# Altium project Deepth-Sapphire-MP2.PrjPcb
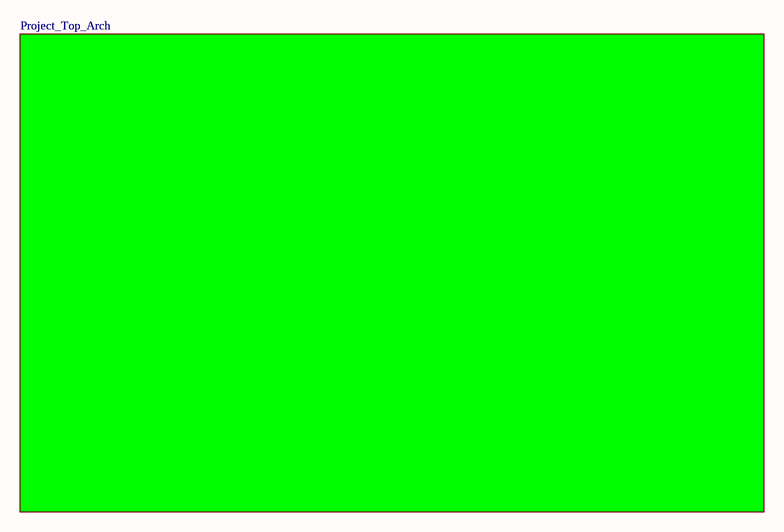
[diagram p0: Project_Overview.SchDoc]
5 sheets, 13 parts. Net scope: global (net labels, ports and power ports of the same name join across sheets).
Board file: PCB.PcbDoc
Sheets:
  Project_Overview.SchDoc
    Project_Top_Arch = Project_Top_Arch.SchDoc
      Power_PMIC = Power_PMIC.SchDoc
      Power_MPU = Power_MPU.SchDoc
      LPDDR4_32Bits = LPDDR4_32Bits.SchDoc

## Sheet Project_Overview.SchDoc
size A2; SheetNumber: 1; SheetTotal: 5

### Sub-sheets
Project_Top_Arch = Project_Top_Arch: no entries

## Sheet Project_Top_Arch.SchDoc
size A2; SheetNumber: 2; SheetTotal: 5
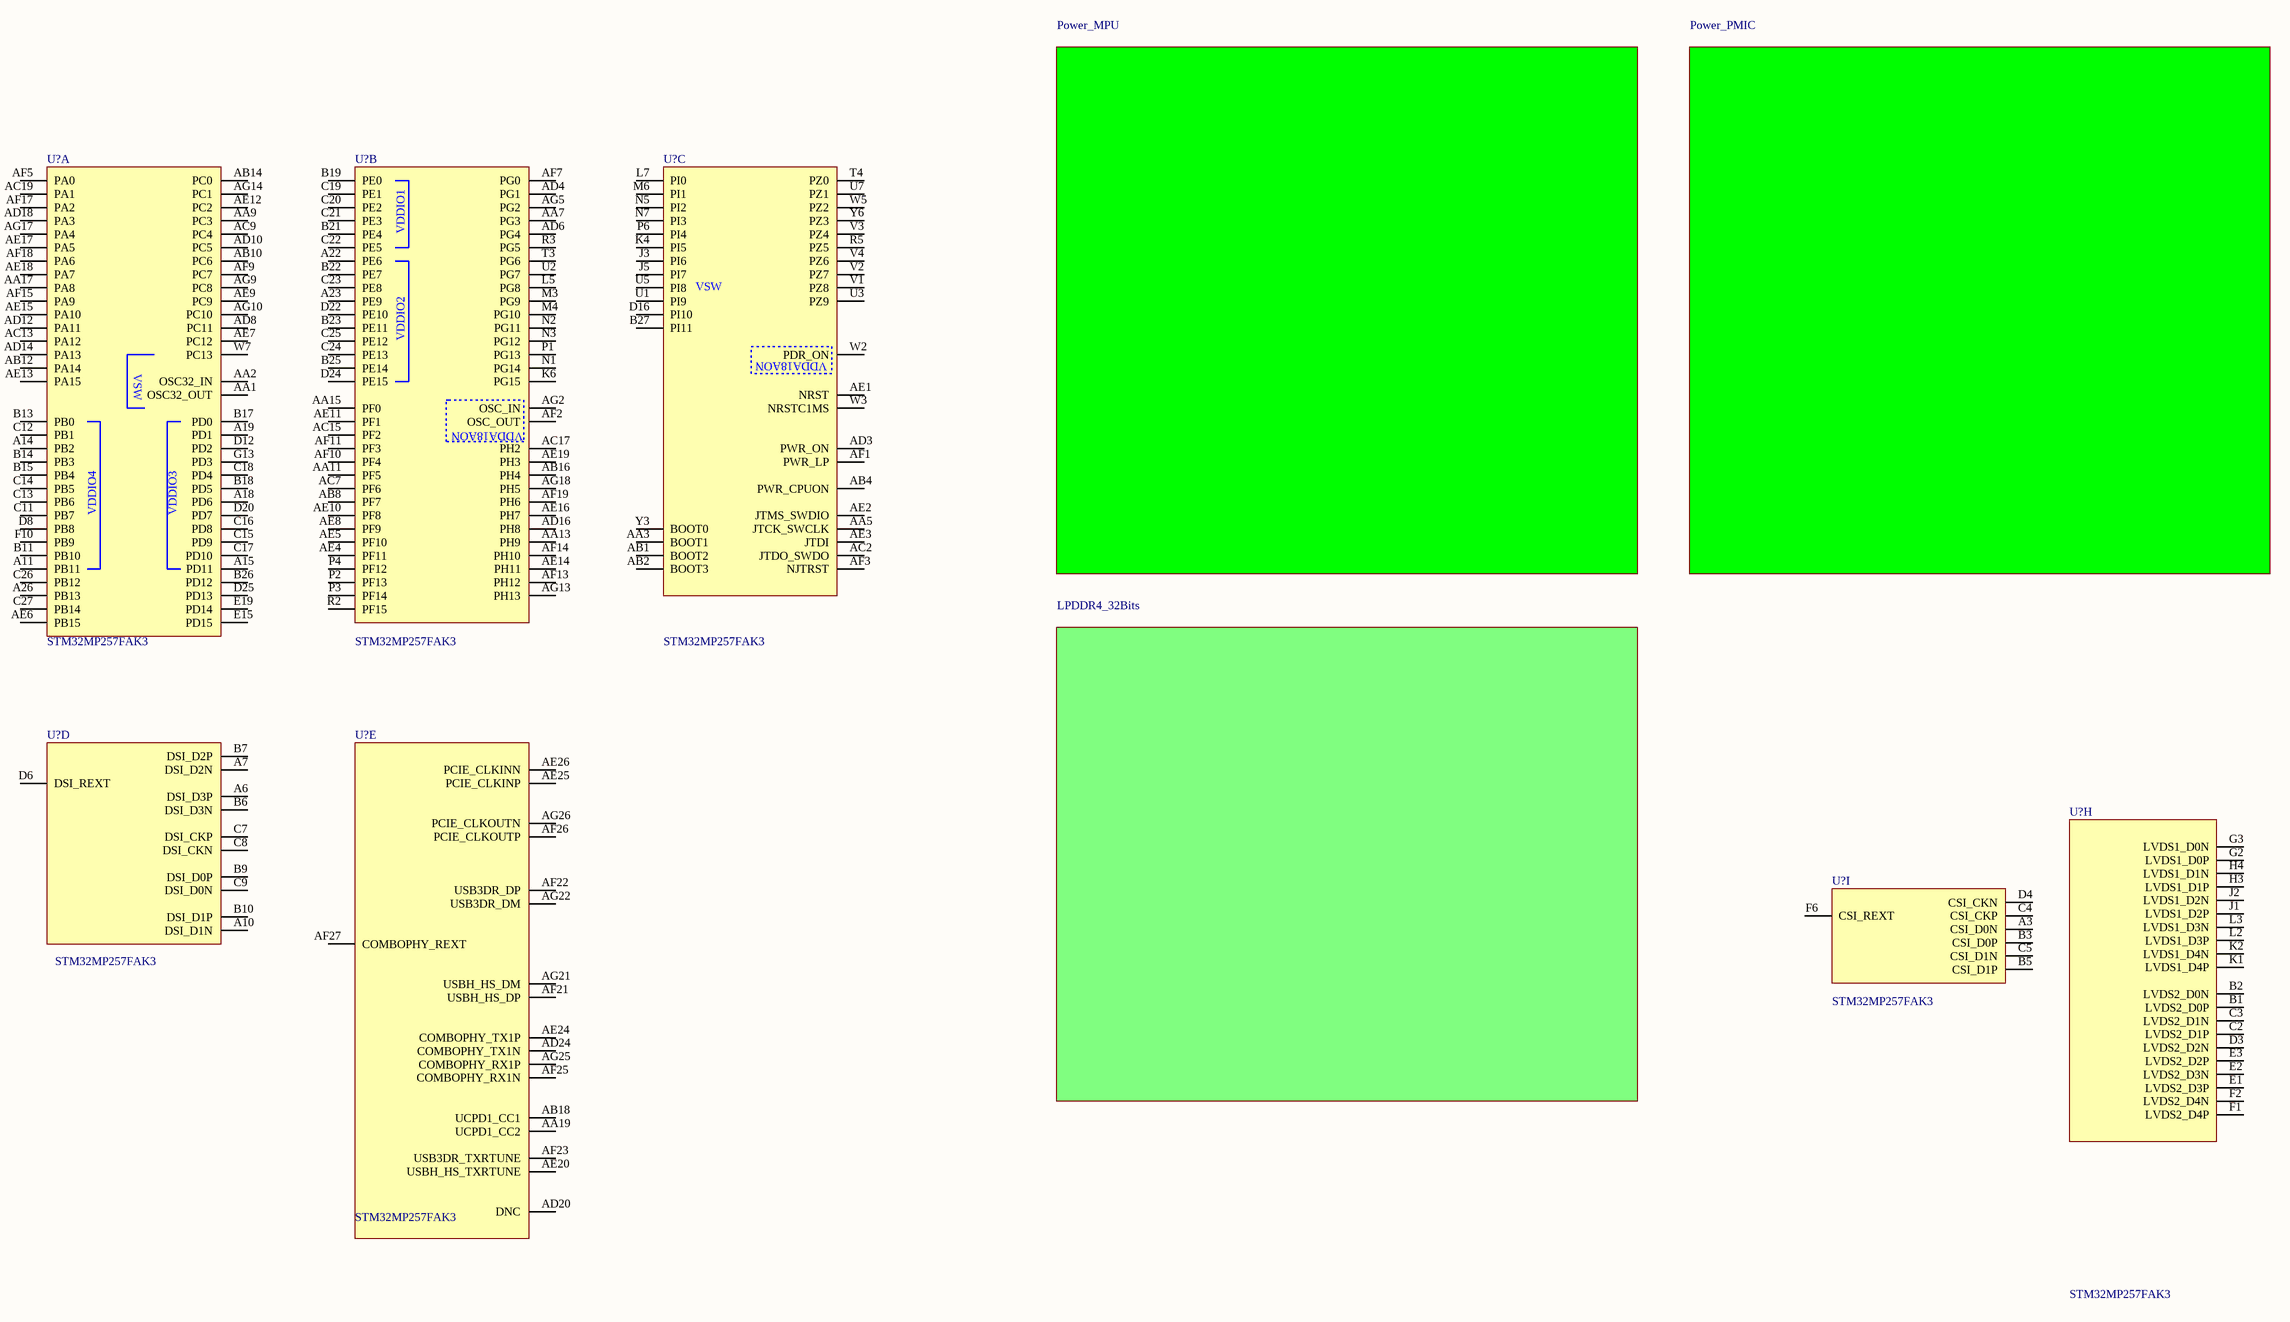
[diagram p1: Project_Top_Arch.SchDoc]

### Parts
(Parts that share a designator on the sheet are numbered #1, #2 ... from top to bottom, then left to right.)
U?#1  STM32MP257FAK3  [ICC_TFBGA424_14X14_P050_H1P20_CODE-B0A2]  (part A of 9)
U?#2  STM32MP257FAK3  [ICC_TFBGA424_14X14_P050_H1P20_CODE-B0A2]  (part B of 9)
U?#3  STM32MP257FAK3  [ICC_TFBGA424_14X14_P050_H1P20_CODE-B0A2]  (part C of 9)
U?#4  STM32MP257FAK3  [ICC_TFBGA424_14X14_P050_H1P20_CODE-B0A2]  (part D of 9)
U?#5  STM32MP257FAK3  [ICC_TFBGA424_14X14_P050_H1P20_CODE-B0A2]  (part E of 9)
U?#6  STM32MP257FAK3  [ICC_TFBGA424_14X14_P050_H1P20_CODE-B0A2]  (part H of 9)
U?#7  STM32MP257FAK3  [ICC_TFBGA424_14X14_P050_H1P20_CODE-B0A2]  (part I of 9)

### Sub-sheets
LPDDR4_32Bits = LPDDR4_32Bits: no entries
Power_MPU = Power_MPU: no entries
Power_PMIC = Power_PMIC: no entries

### Nets

Not connected (* = marked no-connect by the designer): U?#1 A11(PB11) A14(PB2) A15(PD11) A18(PD6) A19(PD1) A26(PB13) AA1(OSC32_OUT) AA2(OSC32_IN) AA9(PC3) AA17(PA8) AB10(PC6) AB12(PA14) AB14(PC0) AC9(PC4) AC13(PA12) AC19(PA1) AD8(PC11) AD10(PC5) AD12(PA11) AD14(PA13) AD18(PA3) AE6(PB15) AE7(PC12) AE9(PC9) AE12(PC2) AE13(PA15) AE15(PA10) AE17(PA5) AE18(PA7) AF5(PA0) AF9(PC7) AF15(PA9) AF17(PA2) AF18(PA6) AG9(PC8) AG10(PC10) AG14(PC1) AG17(PA4) B11(PB10) B13(PB0) B14(PB3) B15(PB4) B17(PD0) B18(PD5) B26(PD12) C11(PB7) C12(PB1) C13(PB6) C14(PB5) C15(PD9) C16(PD8) C17(PD10) C18(PD4) C26(PB12) C27(PB14) D8(PB8) D12(PD2) D20(PD7) D25(PD13) E15(PD15) E19(PD14) F10(PB9) G13(PD3) W7(PC13); U?#2 A22(PE6) A23(PE9) AA7(PG3) AA11(PF5) AA13(PH9) AA15(PF0) AB8(PF7) AB16(PH4) AC7(PF6) AC15(PF2) AC17(PH2) AD4(PG1) AD6(PG4) AD16(PH8) AE4(PF11) AE5(PF10) AE8(PF9) AE10(PF8) AE11(PF1) AE14(PH11) AE16(PH7) AE19(PH3) AF2(OSC_OUT) AF7(PG0) AF10(PF4) AF11(PF3) AF13(PH12) AF14(PH10) AF19(PH6) AG2(OSC_IN) AG5(PG2) AG13(PH13) AG18(PH5) B19(PE0) B21(PE4) B22(PE7) B23(PE11) B25(PE14) C19(PE1) C20(PE2) C21(PE3) C22(PE5) C23(PE8) C24(PE13) C25(PE12) D22(PE10) D24(PE15) K6(PG15) L5(PG8) M3(PG9) M4(PG10) N1(PG14) N2(PG11) N3(PG12) P1(PG13) P2(PF13) P3(PF14) P4(PF12) R2(PF15) R3(PG5) T3(PG6) U2(PG7); U?#3 AA3(BOOT1) AA5(JTCK_SWCLK) AB1(BOOT2) AB2(BOOT3) AB4(PWR_CPUON) AC2(JTDO_SWDO) AD3(PWR_ON) AE1(NRST) AE2(JTMS_SWDIO) AE3(JTDI) AF1(PWR_LP) AF3(NJTRST) B27(PI11) D16(PI10) J3(PI6) J5(PI7) K4(PI5) L7(PI0) M6(PI1) N5(PI2) N7(PI3) P6(PI4) R5(PZ5) T4(PZ0) U1(PI9) U3(PZ9) U5(PI8) U7(PZ1) V1(PZ8) V2(PZ7) V3(PZ4) V4(PZ6) W2(PDR_ON) W3(NRSTC1MS) W5(PZ2) Y3(BOOT0) Y6(PZ3); U?#4 A6(DSI_D3P) A7(DSI_D2N) A10(DSI_D1N) B6(DSI_D3N) B7(DSI_D2P) B9(DSI_D0P) B10(DSI_D1P) C7(DSI_CKP) C8(DSI_CKN) C9(DSI_D0N) D6(DSI_REXT); U?#5 AA19(UCPD1_CC2) AB18(UCPD1_CC1) AD20(DNC) AD24(COMBOPHY_TX1N) AE20(USBH_HS_TXRTUNE) AE24(COMBOPHY_TX1P) AE25(PCIE_CLKINP) AE26(PCIE_CLKINN) AF21(USBH_HS_DP) AF22(USB3DR_DP) AF23(USB3DR_TXRTUNE) AF25(COMBOPHY_RX1N) AF26(PCIE_CLKOUTP) AF27(COMBOPHY_REXT) AG21(USBH_HS_DM) AG22(USB3DR_DM) AG25(COMBOPHY_RX1P) AG26(PCIE_CLKOUTN); U?#6 B1(LVDS2_D0P) B2(LVDS2_D0N) C2(LVDS2_D1P) C3(LVDS2_D1N) D3(LVDS2_D2N) E1(LVDS2_D3P) E2(LVDS2_D3N) E3(LVDS2_D2P) F1(LVDS2_D4P) F2(LVDS2_D4N) G2(LVDS1_D0P) G3(LVDS1_D0N) H3(LVDS1_D1P) H4(LVDS1_D1N) J1(LVDS1_D2P) J2(LVDS1_D2N) K1(LVDS1_D4P) K2(LVDS1_D4N) L2(LVDS1_D3P) L3(LVDS1_D3N); U?#7 A3(CSI_D0N) B3(CSI_D0P) B5(CSI_D1P) C4(CSI_CKP) C5(CSI_D1N) D4(CSI_CKN) F6(CSI_REXT)

### Notes on the sheet
- (in symbol STM32MP257FAK3_1, part A) VSW
- (in symbol STM32MP257FAK3_1, part C) VSW

### Library data of the parts
U?#1-U?#7 = STM32MP257FAK3_1: MPU , 2xCortex-A35@1.5GHz, Cortex-M33@400MHz, TFBGA 14x14, pitch 0.5, 648KB SRAM, With Crypto; Internal_Part_Number: MCD-03375; Part_Type: IC; Part_Preference: Recommended; Manufacturer: STMICROELECTRONICS; Component_Country_Of_Origin: Unknown; ShowFields: YES; ID: 5491; Value: STM32MP257FAK3; Status: Checked; Manufacturer_Part_Number: STM32MP257FAK3; Package: TFBGA; ComponentLink1URL: http://tunmcdsvn.tun.st.com/Component_Documentation_Library/Trunk/IC/STMICROELECTRONICS_STM32MP257FAK3; Order_Code_Digikey: N/A; Order_Code_Farnell: N/A; Order_Code_RS: N/A

## Sheet Power_PMIC.SchDoc
size A2; SheetNumber: 3; SheetTotal: 5

## Sheet Power_MPU.SchDoc
size A2; SheetNumber: 4; SheetTotal: 5
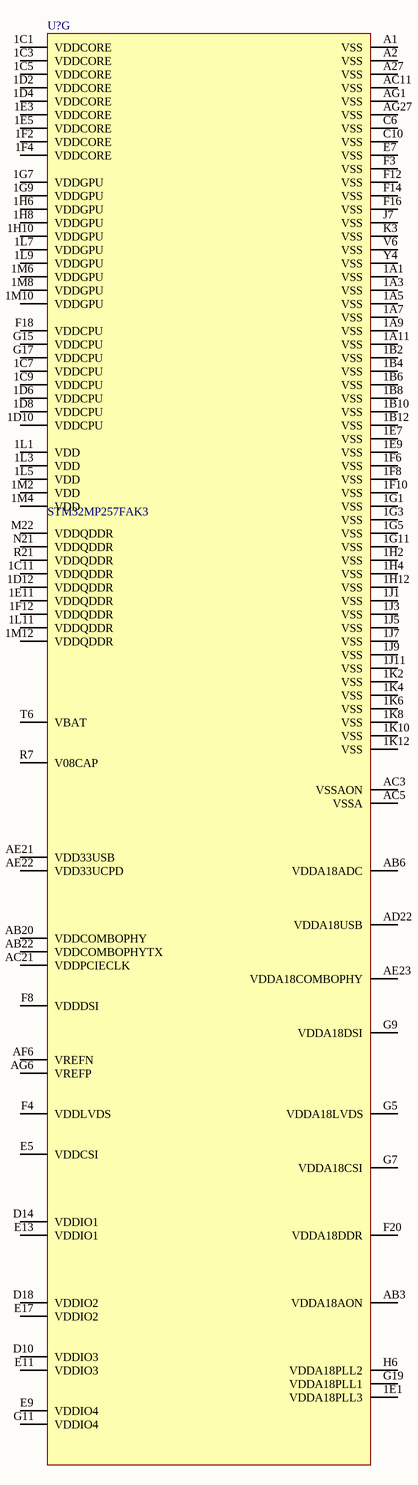
[diagram p2: Power_MPU.SchDoc]

### Parts
(Parts that share a designator on the sheet are numbered #1, #2 ... from top to bottom, then left to right.)
U?#8  STM32MP257FAK3  [ICC_TFBGA424_14X14_P050_H1P20_CODE-B0A2]  (part G of 9)

### Nets

Not connected (* = marked no-connect by the designer): U?#8 1A1(VSS) 1A3(VSS) 1A5(VSS) 1A7(VSS) 1A9(VSS) 1A11(VSS) 1B2(VSS) 1B4(VSS) 1B6(VSS) 1B8(VSS) 1B10(VSS) 1B12(VSS) 1C1(VDDCORE) 1C3(VDDCORE) 1C5(VDDCORE) 1C7(VDDCPU) 1C9(VDDCPU) 1C11(VDDQDDR) 1D2(VDDCORE) 1D4(VDDCORE) 1D6(VDDCPU) 1D8(VDDCPU) 1D10(VDDCPU) 1D12(VDDQDDR) 1E1(VDDA18PLL3) 1E3(VDDCORE) 1E5(VDDCORE) 1E7(VSS) 1E9(VSS) 1E11(VDDQDDR) 1F2(VDDCORE) 1F4(VDDCORE) 1F6(VSS) 1F8(VSS) 1F10(VSS) 1F12(VDDQDDR) 1G1(VSS) 1G3(VSS) 1G5(VSS) 1G7(VDDGPU) 1G9(VDDGPU) 1G11(VSS) 1H2(VSS) 1H4(VSS) 1H6(VDDGPU) 1H8(VDDGPU) 1H10(VDDGPU) 1H12(VSS) 1J1(VSS) 1J3(VSS) 1J5(VSS) 1J7(VSS) 1J9(VSS) 1J11(VSS) 1K2(VSS) 1K4(VSS) 1K6(VSS) 1K8(VSS) 1K10(VSS) 1K12(VSS) 1L1(VDD) 1L3(VDD) 1L5(VDD) 1L7(VDDGPU) 1L9(VDDGPU) 1L11(VDDQDDR) 1M2(VDD) 1M4(VDD) 1M6(VDDGPU) 1M8(VDDGPU) 1M10(VDDGPU) 1M12(VDDQDDR) A1(VSS) A2(VSS) A27(VSS) AB3(VDDA18AON) AB6(VDDA18ADC) AB20(VDDCOMBOPHY) AB22(VDDCOMBOPHYTX) AC3(VSSAON) AC5(VSSA) AC11(VSS) AC21(VDDPCIECLK) AD22(VDDA18USB) AE21(VDD33USB) AE22(VDD33UCPD) AE23(VDDA18COMBOPHY) AF6(VREFN) AG1(VSS) AG6(VREFP) AG27(VSS) C6(VSS) C10(VSS) D10(VDDIO3) D14(VDDIO1) D18(VDDIO2) E5(VDDCSI) E7(VSS) E9(VDDIO4) E11(VDDIO3) E13(VDDIO1) E17(VDDIO2) F3(VSS) F4(VDDLVDS) F8(VDDDSI) F12(VSS) F14(VSS) F16(VSS) F18(VDDCPU) F20(VDDA18DDR) G5(VDDA18LVDS) G7(VDDA18CSI) G9(VDDA18DSI) G11(VDDIO4) G15(VDDCPU) G17(VDDCPU) G19(VDDA18PLL1) H6(VDDA18PLL2) J7(VSS) K3(VSS) M22(VDDQDDR) N21(VDDQDDR) R7(V08CAP) R21(VDDQDDR) T6(VBAT) V6(VSS) Y4(VSS)

### Library data of the parts
U?#8 = STM32MP257FAK3_1: as U?#1 on sheet Project_Top_Arch; Value: STM32MP257FAK3; Status: Checked; Manufacturer_Part_Number: STM32MP257FAK3; Package: TFBGA; ComponentLink1URL: http://tunmcdsvn.tun.st.com/Component_Documentation_Library/Trunk/IC/STMICROELECTRONICS_STM32MP257FAK3; Order_Code_Digikey: N/A; Order_Code_Farnell: N/A; Order_Code_RS: N/A

## Sheet LPDDR4_32Bits.SchDoc
size A3; SheetNumber: 5; SheetTotal: 5
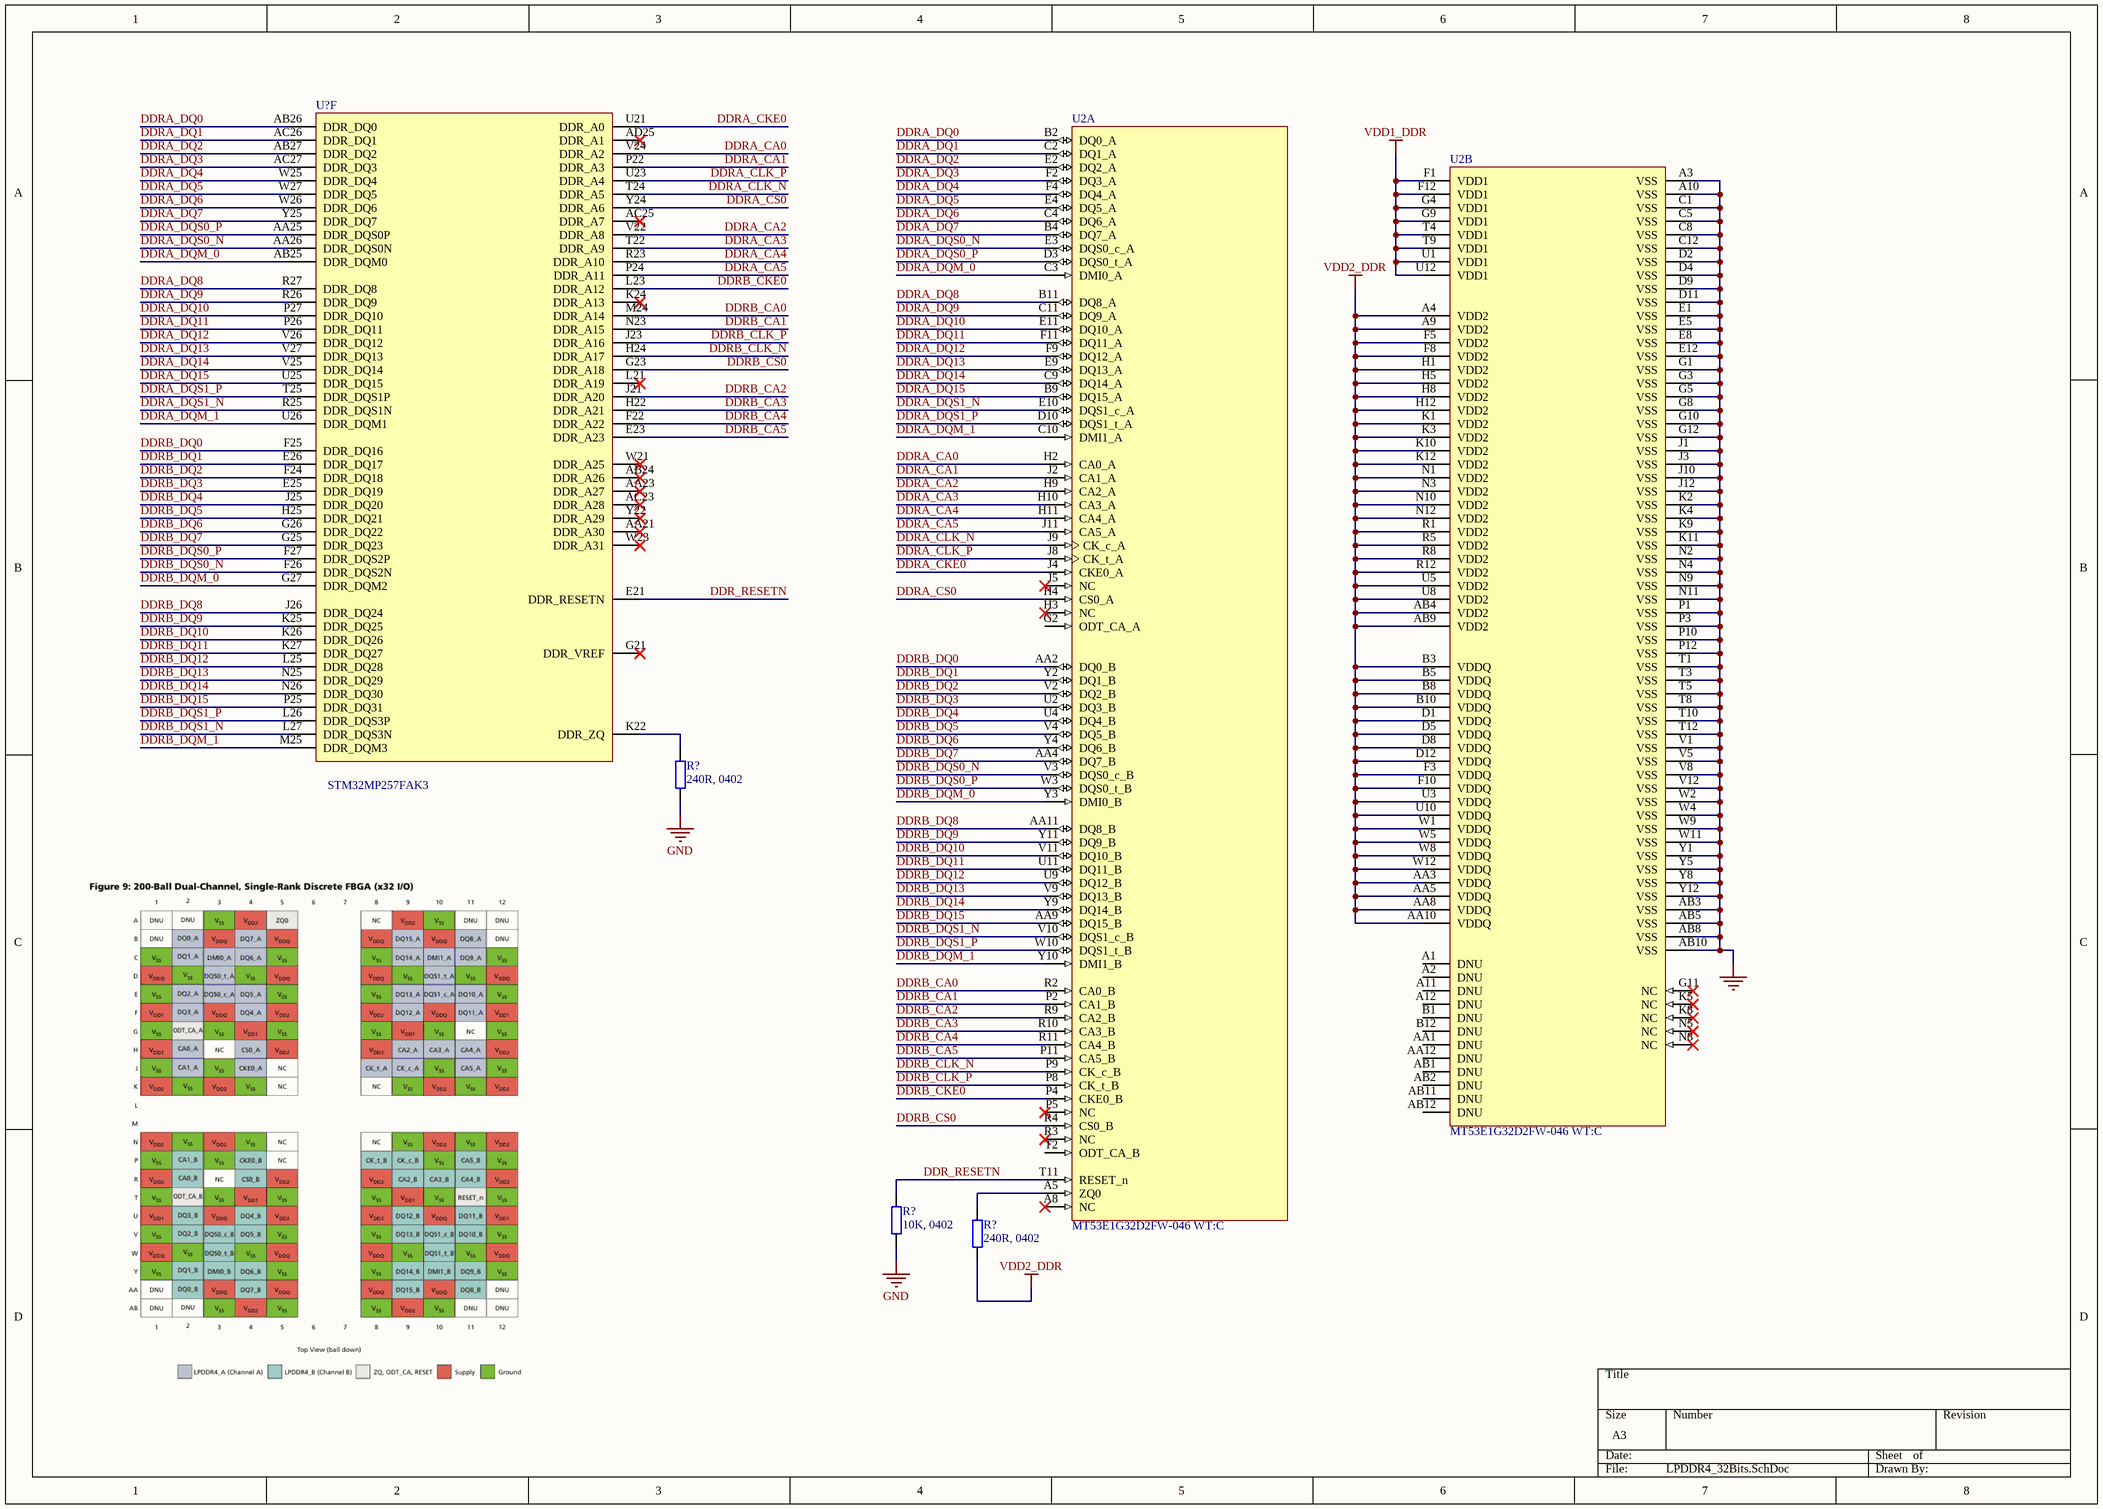
[diagram p3: LPDDR4_32Bits.SchDoc]

### Parts
(Parts that share a designator on the sheet are numbered #1, #2 ... from top to bottom, then left to right.)
R?#1  240R, 0402  [RES_0402]
R?#2  10K, 0402  [RES_0402]
R?#3  240R, 0402  [RES_0402]
U2  MT53E1G32D2FW-046 WT:C  [ICC_TFBGA200_10X14P5_P080_H1P05_PS0P3]  (parts A,B of 2)
U?#9  STM32MP257FAK3  [ICC_TFBGA424_14X14_P050_H1P20_CODE-B0A2]  (part F of 9)

### Nets
GND: R?#1.1 R?#2.1 U2.A3(VSS) U2.A10(VSS) U2.AB3(VSS) U2.AB5(VSS) U2.AB8(VSS) U2.AB10(VSS) U2.C1(VSS) U2.C5(VSS) U2.C8(VSS) U2.C12(VSS) U2.D2(VSS) U2.D4(VSS) U2.D9(VSS) U2.D11(VSS) U2.E1(VSS) U2.E5(VSS) U2.E8(VSS) U2.E12(VSS) U2.G1(VSS) U2.G3(VSS) U2.G5(VSS) U2.G8(VSS) U2.G10(VSS) U2.G12(VSS) U2.J1(VSS) U2.J3(VSS) U2.J10(VSS) U2.J12(VSS) U2.K2(VSS) U2.K4(VSS) U2.K9(VSS) U2.K11(VSS) U2.N2(VSS) U2.N4(VSS) U2.N9(VSS) U2.N11(VSS) U2.P1(VSS) U2.P3(VSS) U2.P10(VSS) U2.P12(VSS) U2.T1(VSS) U2.T3(VSS) U2.T5(VSS) U2.T8(VSS) U2.T10(VSS) U2.T12(VSS) U2.V1(VSS) U2.V5(VSS) U2.V8(VSS) U2.V12(VSS) U2.W2(VSS) U2.W4(VSS) U2.W9(VSS) U2.W11(VSS) U2.Y1(VSS) U2.Y5(VSS) U2.Y8(VSS) U2.Y12(VSS)
VDD1_DDR: U2.F1(VDD1) U2.F12(VDD1) U2.G4(VDD1) U2.G9(VDD1) U2.T4(VDD1) U2.T9(VDD1) U2.U1(VDD1) U2.U12(VDD1)
VDD2_DDR: R?#3.1 U2.A4(VDD2) U2.A9(VDD2) U2.AA3(VDDQ) U2.AA5(VDDQ) U2.AA8(VDDQ) U2.AA10(VDDQ) U2.AB4(VDD2) U2.AB9(VDD2) U2.B3(VDDQ) U2.B5(VDDQ) U2.B8(VDDQ) U2.B10(VDDQ) U2.D1(VDDQ) U2.D5(VDDQ) U2.D8(VDDQ) U2.D12(VDDQ) U2.F3(VDDQ) U2.F5(VDD2) U2.F8(VDD2) U2.F10(VDDQ) U2.H1(VDD2) U2.H5(VDD2) U2.H8(VDD2) U2.H12(VDD2) U2.K1(VDD2) U2.K3(VDD2) U2.K10(VDD2) U2.K12(VDD2) U2.N1(VDD2) U2.N3(VDD2) U2.N10(VDD2) U2.N12(VDD2) U2.R1(VDD2) U2.R5(VDD2) U2.R8(VDD2) U2.R12(VDD2) U2.U3(VDDQ) U2.U5(VDD2) U2.U8(VDD2) U2.U10(VDDQ) U2.W1(VDDQ) U2.W5(VDDQ) U2.W8(VDDQ) U2.W12(VDDQ)
DDR_RESETN: R?#2.2 U2.T11(RESET_n) U?#9.E21(DDR_RESETN)
DDRA_CA0: U2.H2(CA0_A) U?#9.V24(DDR_A2)
DDRA_CA1: U2.J2(CA1_A) U?#9.P22(DDR_A3)
DDRA_CA2: U2.H9(CA2_A) U?#9.V22(DDR_A8)
DDRA_CA3: U2.H10(CA3_A) U?#9.T22(DDR_A9)
DDRA_CA4: U2.H11(CA4_A) U?#9.R23(DDR_A10)
DDRA_CA5: U2.J11(CA5_A) U?#9.P24(DDR_A11)
DDRA_CKE0: U2.J4(CKE0_A) U?#9.U21(DDR_A0)
DDRA_CLK_N: U2.J9(CK_c_A) U?#9.T24(DDR_A5)
DDRA_CLK_P: U2.J8(CK_t_A) U?#9.U23(DDR_A4)
DDRA_CS0: U2.H4(CS0_A) U?#9.Y24(DDR_A6)
DDRA_DQ0: U2.B2(DQ0_A) U?#9.AB26(DDR_DQ0)
DDRA_DQ1: U2.C2(DQ1_A) U?#9.AC26(DDR_DQ1)
DDRA_DQ2: U2.E2(DQ2_A) U?#9.AB27(DDR_DQ2)
DDRA_DQ3: U2.F2(DQ3_A) U?#9.AC27(DDR_DQ3)
DDRA_DQ4: U2.F4(DQ4_A) U?#9.W25(DDR_DQ4)
DDRA_DQ5: U2.E4(DQ5_A) U?#9.W27(DDR_DQ5)
DDRA_DQ6: U2.C4(DQ6_A) U?#9.W26(DDR_DQ6)
DDRA_DQ7: U2.B4(DQ7_A) U?#9.Y25(DDR_DQ7)
DDRA_DQ8: U2.B11(DQ8_A) U?#9.R27(DDR_DQ8)
DDRA_DQ9: U2.C11(DQ9_A) U?#9.R26(DDR_DQ9)
DDRA_DQ10: U2.E11(DQ10_A) U?#9.P27(DDR_DQ10)
DDRA_DQ11: U2.F11(DQ11_A) U?#9.P26(DDR_DQ11)
DDRA_DQ12: U2.F9(DQ12_A) U?#9.V26(DDR_DQ12)
DDRA_DQ13: U2.E9(DQ13_A) U?#9.V27(DDR_DQ13)
DDRA_DQ14: U2.C9(DQ14_A) U?#9.V25(DDR_DQ14)
DDRA_DQ15: U2.B9(DQ15_A) U?#9.U25(DDR_DQ15)
DDRA_DQM_0: U2.C3(DMI0_A) U?#9.AB25(DDR_DQM0)
DDRA_DQM_1: U2.C10(DMI1_A) U?#9.U26(DDR_DQM1)
DDRA_DQS0_N: U2.E3(DQS0_c_A) U?#9.AA26(DDR_DQS0N)
DDRA_DQS0_P: U2.D3(DQS0_t_A) U?#9.AA25(DDR_DQS0P)
DDRA_DQS1_N: U2.E10(DQS1_c_A) U?#9.R25(DDR_DQS1N)
DDRA_DQS1_P: U2.D10(DQS1_t_A) U?#9.T25(DDR_DQS1P)
DDRB_CA0: U2.R2(CA0_B) U?#9.M24(DDR_A14)
DDRB_CA1: U2.P2(CA1_B) U?#9.N23(DDR_A15)
DDRB_CA2: U2.R9(CA2_B) U?#9.J21(DDR_A20)
DDRB_CA3: U2.R10(CA3_B) U?#9.H22(DDR_A21)
DDRB_CA4: U2.R11(CA4_B) U?#9.F22(DDR_A22)
DDRB_CA5: U2.P11(CA5_B) U?#9.E23(DDR_A23)
DDRB_CKE0: U2.P4(CKE0_B) U?#9.L23(DDR_A12)
DDRB_CLK_N: U2.P9(CK_c_B) U?#9.H24(DDR_A17)
DDRB_CLK_P: U2.P8(CK_t_B) U?#9.J23(DDR_A16)
DDRB_CS0: U2.R4(CS0_B) U?#9.G23(DDR_A18)
DDRB_DQ0: U2.AA2(DQ0_B) U?#9.F25(DDR_DQ16)
DDRB_DQ1: U2.Y2(DQ1_B) U?#9.E26(DDR_DQ17)
DDRB_DQ2: U2.V2(DQ2_B) U?#9.F24(DDR_DQ18)
DDRB_DQ3: U2.U2(DQ3_B) U?#9.E25(DDR_DQ19)
DDRB_DQ4: U2.U4(DQ4_B) U?#9.J25(DDR_DQ20)
DDRB_DQ5: U2.V4(DQ5_B) U?#9.H25(DDR_DQ21)
DDRB_DQ6: U2.Y4(DQ6_B) U?#9.G26(DDR_DQ22)
DDRB_DQ7: U2.AA4(DQ7_B) U?#9.G25(DDR_DQ23)
DDRB_DQ8: U2.AA11(DQ8_B) U?#9.J26(DDR_DQ24)
DDRB_DQ9: U2.Y11(DQ9_B) U?#9.K25(DDR_DQ25)
DDRB_DQ10: U2.V11(DQ10_B) U?#9.K26(DDR_DQ26)
DDRB_DQ11: U2.U11(DQ11_B) U?#9.K27(DDR_DQ27)
DDRB_DQ12: U2.U9(DQ12_B) U?#9.L25(DDR_DQ28)
DDRB_DQ13: U2.V9(DQ13_B) U?#9.N25(DDR_DQ29)
DDRB_DQ14: U2.Y9(DQ14_B) U?#9.N26(DDR_DQ30)
DDRB_DQ15: U2.AA9(DQ15_B) U?#9.P25(DDR_DQ31)
DDRB_DQM_0: U2.Y3(DMI0_B) U?#9.G27(DDR_DQM2)
DDRB_DQM_1: U2.Y10(DMI1_B) U?#9.M25(DDR_DQM3)
DDRB_DQS0_N: U2.V3(DQS0_c_B) U?#9.F26(DDR_DQS2N)
DDRB_DQS0_P: U2.W3(DQS0_t_B) U?#9.F27(DDR_DQS2P)
DDRB_DQS1_N: U2.V10(DQS1_c_B) U?#9.L27(DDR_DQS3N)
DDRB_DQS1_P: U2.W10(DQS1_t_B) U?#9.L26(DDR_DQS3P)
NetR?#1_2: R?#1.2 U?#9.K22(DDR_ZQ)
NetR?#3_2: R?#3.2 U2.A5(ZQ0)

Not connected (* = marked no-connect by the designer): U2 A1(DNU) A2(DNU) A8(NC)* A11(DNU) A12(DNU) AA1(DNU) AA12(DNU) AB1(DNU) AB2(DNU) AB11(DNU) AB12(DNU) B1(DNU) B12(DNU) G2(ODT_CA_A) G11(NC)* H3(NC)* J5(NC)* K5(NC)* K8(NC)* N5(NC)* N8(NC)* P5(NC)* R3(NC)* T2(ODT_CA_B); U?#9 AA21(DDR_A30)* AA23(DDR_A27)* AB24(DDR_A26)* AC23(DDR_A28)* AC25(DDR_A7)* AD25(DDR_A1)* G21(DDR_VREF)* K24(DDR_A13)* L21(DDR_A19)* W21(DDR_A25)* W23(DDR_A31)* Y22(DDR_A29)*

### Library data of the parts
R?#1-R?#3 = RES_0402: Resistor SMD 0402; Manufacturer: *; Manufacturer Part Number: *; Distributor Link: *; LCSC: *
U2 = MT53E1G32D2FW-046 WT:C: Memory, LPDDR4 SDRAM,1V8, 32Gbit, 2133MHz; Internal_Part_Number: MCD-04160; Part_Type: IC; Part_Preference: Recommended; Manufacturer: MICRON; ShowFields: YES; ID: 6276; Status: New; Manufacturer_Part_Number: MT53E1G32D2FW-046 WT:C; Package: TFBGA-200; ComponentLink1URL: http://tunmcdsvn.tun.st.com/Component_Documentation_Library/Trunk/IC/MICRON_MT53E1G32D2FW-046-WT-C; Order_Code_Digikey: 557-MT53E1G32D2FW-046WT:C-ND; Order_Code_Farnell: N/A; Order_Code_RS: N/A; Value: MT53E1G32D2FW-046 WT:C
U?#9 = STM32MP257FAK3_1: as U?#1 on sheet Project_Top_Arch; Value: STM32MP257FAK3; Status: Checked; Manufacturer_Part_Number: STM32MP257FAK3; Package: TFBGA; ComponentLink1URL: http://tunmcdsvn.tun.st.com/Component_Documentation_Library/Trunk/IC/STMICROELECTRONICS_STM32MP257FAK3; Order_Code_Digikey: N/A; Order_Code_Farnell: N/A; Order_Code_RS: N/A